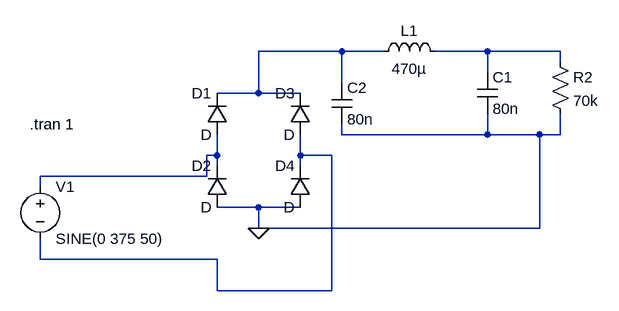
[diagram p0: schematic Draft3.asc]
Draft3.asc, the LTspice schematic file:
Version 4
SHEET 1 980 680
WIRE 528 -48 400 -48
WIRE 592 -48 528 -48
WIRE 752 -48 672 -48
WIRE 864 -48 752 -48
WIRE 864 -32 864 -48
WIRE 752 -16 752 -48
WIRE 528 0 528 -48
WIRE 400 16 400 -48
WIRE 400 16 336 16
WIRE 464 16 400 16
WIRE 528 80 528 64
WIRE 752 80 752 48
WIRE 752 80 528 80
WIRE 832 80 752 80
WIRE 864 80 864 48
WIRE 864 80 832 80
WIRE 336 112 336 80
WIRE 336 112 320 112
WIRE 464 112 464 80
WIRE 512 112 464 112
WIRE 336 128 336 112
WIRE 464 128 464 112
WIRE 320 144 320 112
WIRE 320 144 64 144
WIRE 64 160 64 144
WIRE 400 192 336 192
WIRE 464 192 400 192
WIRE 400 224 400 192
WIRE 832 224 832 80
WIRE 832 224 400 224
WIRE 64 272 64 240
WIRE 336 272 64 272
WIRE 336 320 336 272
WIRE 512 320 512 112
WIRE 512 320 336 320
FLAG 400 224 0
SYMBOL voltage 64 144 R0
WINDOW 123 0 0 Left 0
WINDOW 39 0 0 Left 0
SYMATTR InstName V1
SYMATTR Value SINE(0 375 50)
SYMBOL ind 576 -32 R270
WINDOW 0 32 56 VTop 2
WINDOW 3 5 56 VBottom 2
SYMATTR InstName L1
SYMATTR Value 470µ
SYMBOL cap 736 -16 R0
SYMATTR InstName C1
SYMATTR Value 80n
SYMBOL res 848 -48 R0
SYMATTR InstName R2
SYMATTR Value 70k
SYMBOL diode 352 80 R180
WINDOW 0 24 64 Left 2
WINDOW 3 24 0 Left 2
SYMATTR InstName D1
SYMBOL diode 352 192 R180
WINDOW 0 24 64 Left 2
WINDOW 3 24 0 Left 2
SYMATTR InstName D2
SYMBOL diode 480 80 R180
WINDOW 0 24 64 Left 2
WINDOW 3 24 0 Left 2
SYMATTR InstName D3
SYMBOL diode 480 192 R180
WINDOW 0 24 64 Left 2
WINDOW 3 24 0 Left 2
SYMATTR InstName D4
SYMBOL cap 512 0 R0
SYMATTR InstName C2
SYMATTR Value 80n
TEXT 48 64 Left 2 !.tran 1

The netlist it stands for:
* Draft3.asc
V1 N003 N004 SINE(0 375 50)
L1 N001 N002 470µ
C1 N002 0 80n
R2 N002 0 70k
D1 N003 N001 D
D2 0 N003 D
D3 N004 N001 D
D4 0 N004 D
C2 N001 0 80n
.model D D
.lib standard.dio
.tran 1
.backanno
.end